# Altium schematic sheet LVDS_IFCB.SchDoc: LVDS Interface
size 420 x 297 mm; Author: G.K.; CompanyName: WUT; DrawnBy: G.K.; Organization: CERN; Address1: Warsaw Univeristy of Technology; Address2: Nowowiejska 15/19; DocumentNumber: 4; Revision: -; SheetNumber: 4; SheetTotal: 5; EDA_Number: ARTIQ; Projet: 3U ADC; ModifiedBy: -; CreateDate: XX/XX/XXXX; CheckedDate: -; Title2: I2C logic v1.2; DivGrp: ISE; Designer: G.K.; ModifiedDate: -; ProjectName: 3U ADC
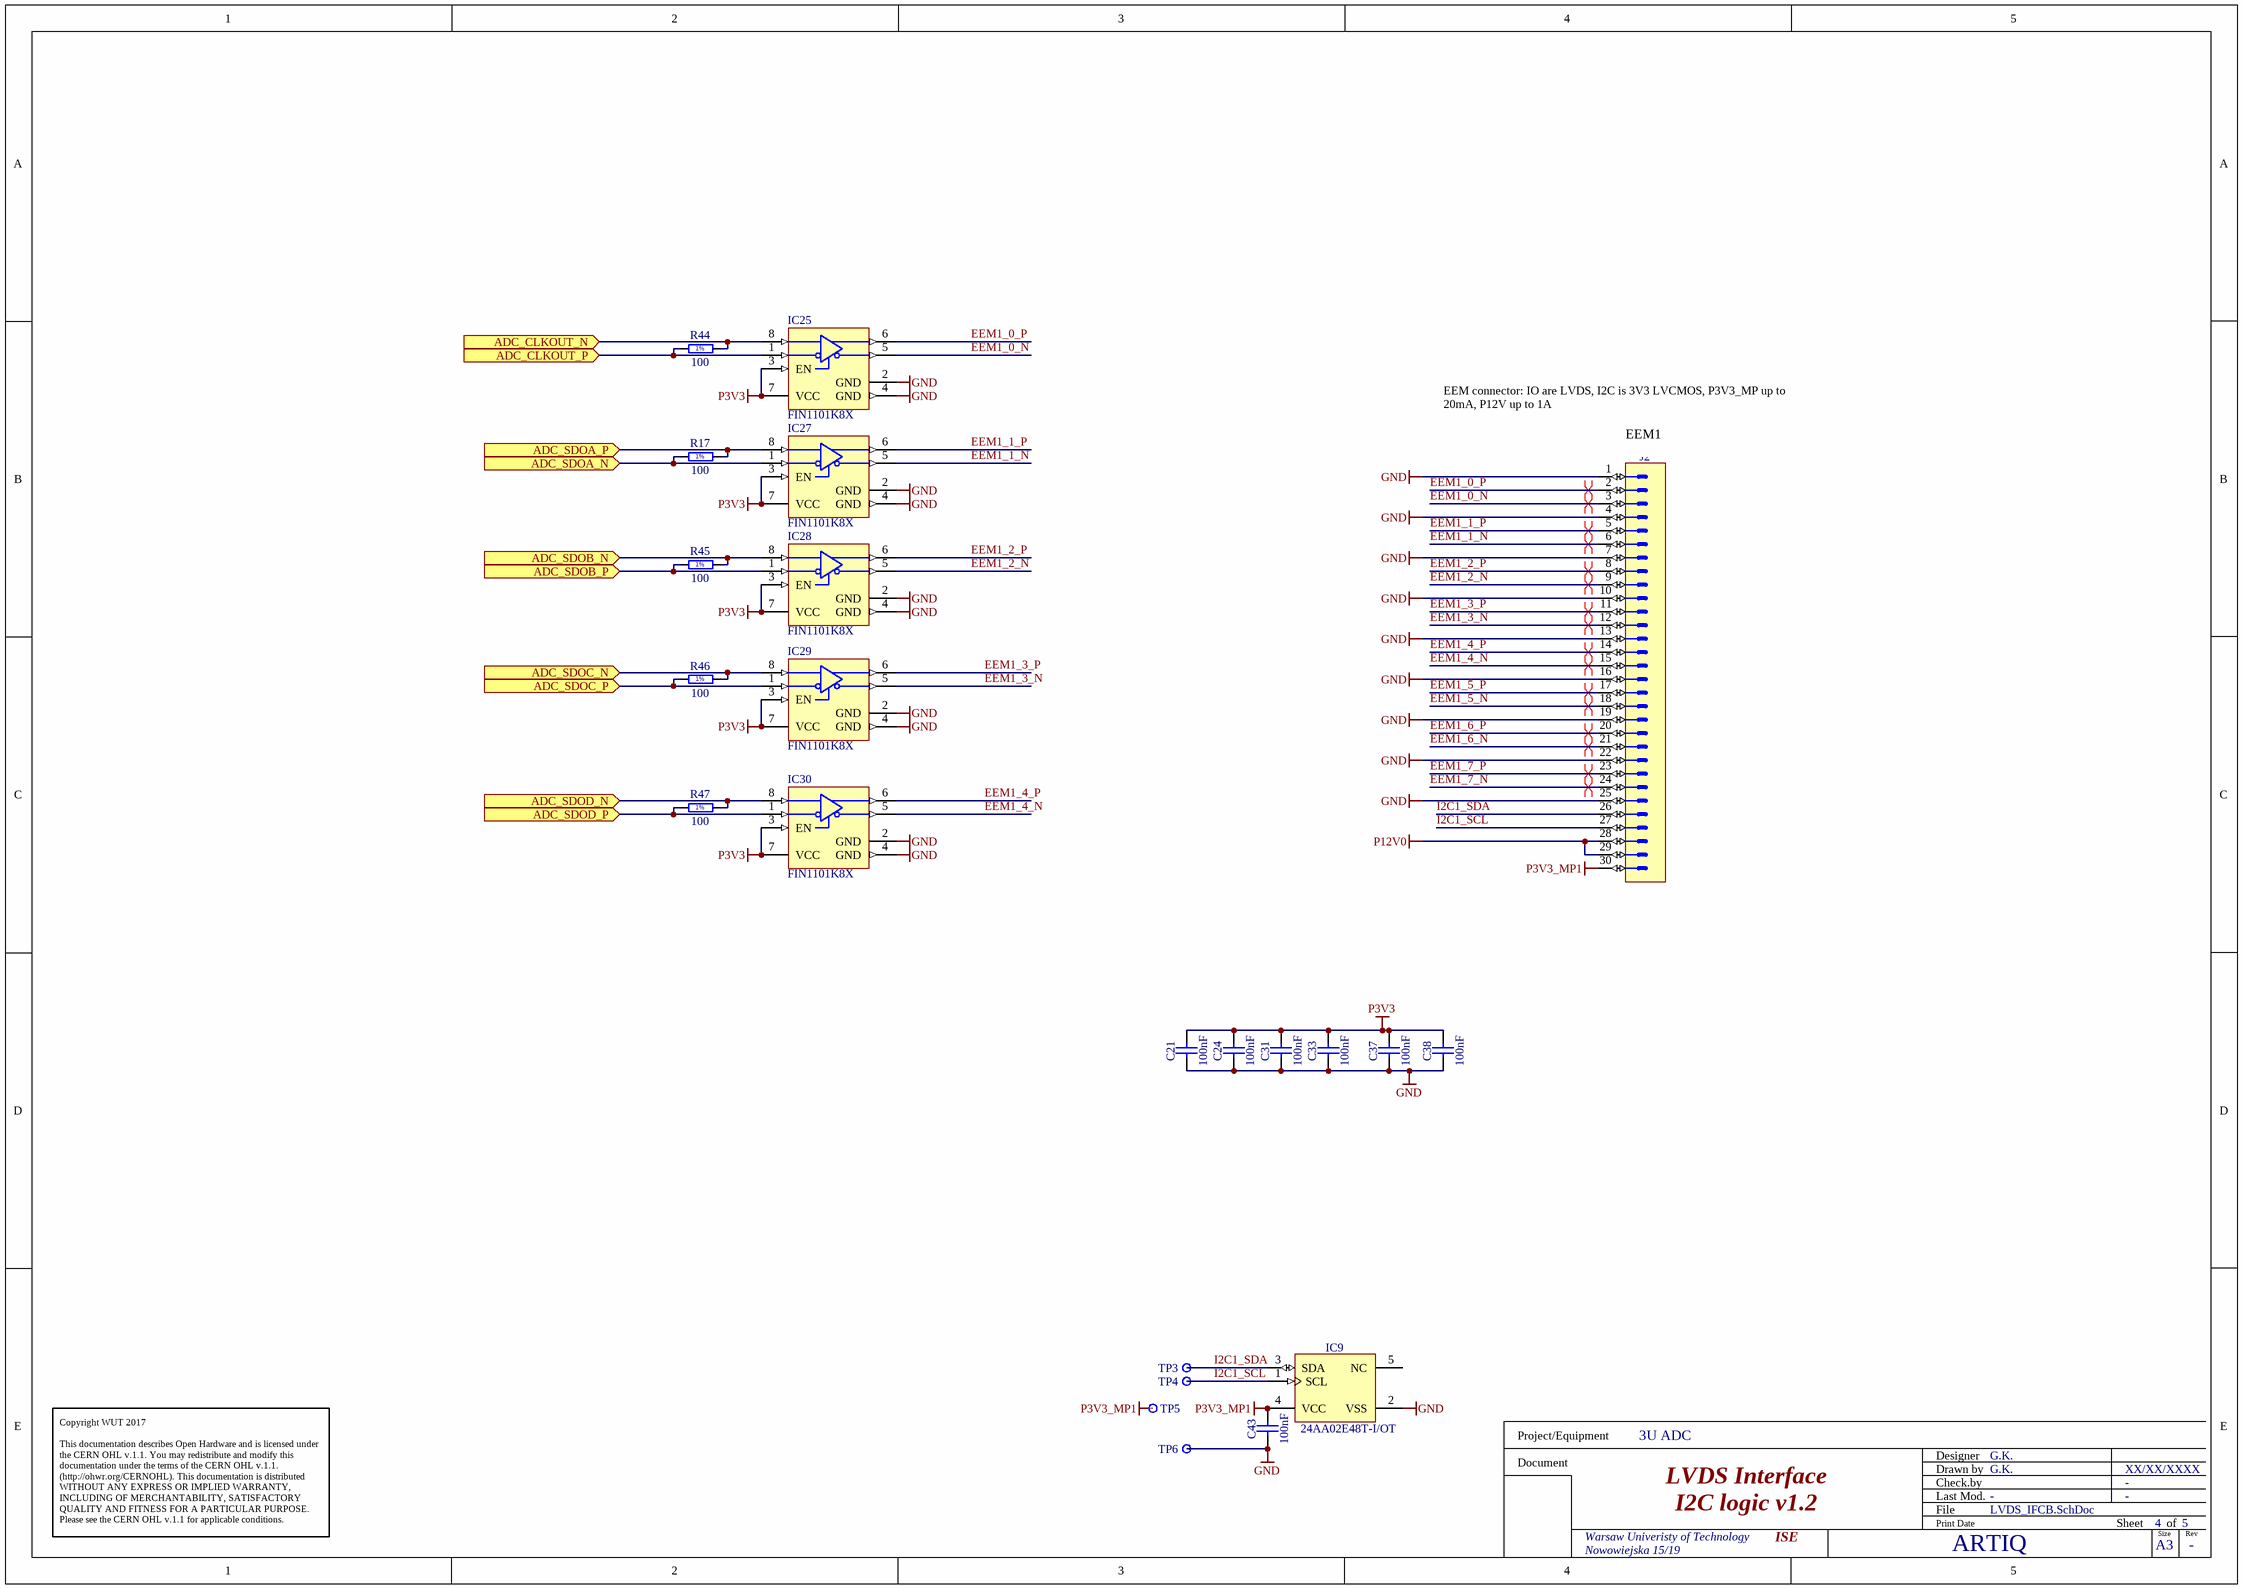
[diagram p0: LVDS_IFCB.SchDoc]

## Parts
C21  100nF  [CAPC1005X55N]
C24  100nF  [CAPC1005X55N]
C31  100nF  [CAPC1005X55N]
C33  100nF  [CAPC1005X55N]
C37  100nF  [CAPC1005X55N]
C38  100nF  [CAPC1005X55N]
C43  100nF  [CAPC1005X55N]
IC9  24AA02E48T-I/OT  [SOT95P280X145-5N]
IC25  FIN1101K8X  [SOP50P310X90-8N]
IC27  FIN1101K8X  [SOP50P310X90-8N]
IC28  FIN1101K8X  [SOP50P310X90-8N]
IC29  FIN1101K8X  [SOP50P310X90-8N]
IC30  FIN1101K8X  [SOP50P310X90-8N]
J2  (no value)  [3M_N2530-6002RB]
R17  100  [RESC1005X40N]
R44  100  [RESC1005X40N]
R45  100  [RESC1005X40N]
R46  100  [RESC1005X40N]
R47  100  [RESC1005X40N]
TP3  Test Point  [TPS127]  (value not drawn)
TP4  Test Point  [TPS127]  (value not drawn)
TP5  Test Point  [TPS127]  (value not drawn)
TP6  Test Point  [TPS127]  (value not drawn)

## Ports
ADC_CLKOUT_N (in), ADC_CLKOUT_P (in), ADC_SDOA_N (in), ADC_SDOA_P (in), ADC_SDOB_N (in), ADC_SDOB_P (in), ADC_SDOC_N (in), ADC_SDOC_P (in), ADC_SDOD_N (in), ADC_SDOD_P (in)

## Nets
GND: C21.1 C24.1 C31.1 C33.1 C37.1 C38.1 C43.1 IC9.2(VSS) IC25.2(GND) IC25.4(GND) IC27.2(GND) IC27.4(GND) IC28.2(GND) IC28.4(GND) IC29.2(GND) IC29.4(GND) IC30.2(GND) IC30.4(GND) J2.1 J2.4 J2.7 J2.10 J2.13 J2.16 J2.19 J2.22 J2.25 TP6.1
P3V3: C21.2 C24.2 C31.2 C33.2 C37.2 C38.2 IC25.3(EN) IC25.7(VCC) IC27.3(EN) IC27.7(VCC) IC28.3(EN) IC28.7(VCC) IC29.3(EN) IC29.7(VCC) IC30.3(EN) IC30.7(VCC)
P3V3_MP1: C43.2 IC9.4(VCC) J2.30 TP5.1
P12V0: J2.28 J2.29
ADC_CLKOUT_N: IC25.8(RIN+) R44.2 ; port ADC_CLKOUT_N
ADC_CLKOUT_P: IC25.1(RIN-) R44.1 ; port ADC_CLKOUT_P
ADC_SDOA_N: IC27.1(RIN-) R17.1 ; port ADC_SDOA_N
ADC_SDOA_P: IC27.8(RIN+) R17.2 ; port ADC_SDOA_P
ADC_SDOB_N: IC28.8(RIN+) R45.2 ; port ADC_SDOB_N
ADC_SDOB_P: IC28.1(RIN-) R45.1 ; port ADC_SDOB_P
ADC_SDOC_N: IC29.8(RIN+) R46.2 ; port ADC_SDOC_N
ADC_SDOC_P: IC29.1(RIN-) R46.1 ; port ADC_SDOC_P
ADC_SDOD_N: IC30.8(RIN+) R47.2 ; port ADC_SDOD_N
ADC_SDOD_P: IC30.1(RIN-) R47.1 ; port ADC_SDOD_P
EEM1_0_N: IC25.5(DOUT-) J2.3
EEM1_0_P: IC25.6(DOUT+) J2.2
EEM1_1_N: IC27.5(DOUT-) J2.6
EEM1_1_P: IC27.6(DOUT+) J2.5
EEM1_2_N: IC28.5(DOUT-) J2.9
EEM1_2_P: IC28.6(DOUT+) J2.8
EEM1_3_N: IC29.5(DOUT-) J2.12
EEM1_3_P: IC29.6(DOUT+) J2.11
EEM1_4_N: IC30.5(DOUT-) J2.15
EEM1_4_P: IC30.6(DOUT+) J2.14
EEM1_5_N: J2.18
EEM1_5_P: J2.17
EEM1_6_N: J2.21
EEM1_6_P: J2.20
EEM1_7_N: J2.24
EEM1_7_P: J2.23
I2C1_SCL: IC9.1(SCL) J2.27 TP4.1
I2C1_SDA: IC9.3(SDA) J2.26 TP3.1

Not connected (* = marked no-connect by the designer): IC9 5(NC)

## Layout directives
differential pair: EEM1_0_N, EEM1_0_P, EEM1_1_N, EEM1_1_P, EEM1_2_N, EEM1_2_P, EEM1_3_N, EEM1_3_P, EEM1_4_N, EEM1_4_P, EEM1_5_N, EEM1_5_P, EEM1_6_N, EEM1_6_P, EEM1_7_N, EEM1_7_P

## Notes on the sheet
- (near J2) EEM connector: IO are LVDS, I2C is 3V3 LVCMOS, P3V3_MP up to 20mA, P12V up to 1A
- (near J2) EEM1
- Copyright WUT 2017
  This documentation describes Open Hardware and is licensed under the CERN OHL v.1.1. You may redistribute and modify this documentation under the terms of the CERN OHL v.1.1. (http://ohwr.org/CERNOHL). This documentation is distributed WITHOUT ANY EXPRESS OR IMPLIED WARRANTY, INCLUDING OF MERCHANTABILITY, SATISFACTORY QUALITY AND FITNESS FOR A PARTICULAR PURPOSE. Please see the CERN OHL v.1.1 for applicable conditions.
- Project/Equipment
- Document
- Designer
- Drawn by
- Check.by
- File
- Last Mod.
- Print Date
- Sheet
- Size
- A3
- of
- Rev
- (in symbol R0402_100R_1%_0.1W_100PPM) 1%

## Library data of the parts
C21 C24 C31 C33 C37 C38 C43 = CC0402_100NF_16V_10%_X5R: Non-polarised capacitor; Part Description: SMD Multilayer Chip Ceramic Capacitor; Manufacturer: GENERIC; Manufacturer1 Part Number: GRM155R61C104KA88D; Voltage: 16V; TC: X5R; Tolerance: ±10%; Part Number: CC0402_100NF_16V_10%_X5R; Component Kind: Standard; Component Type: Standard; Pin Count: 2; Value: 100nF; Status: None; Manufacturer Part Number: CC0402_100NF_16V_10%_X5R; Case: 0402; Mounted: Yes; Socket: No; SMD: Yes; Sense: No; Manufacturer1 Example: MURATA; Manufacturer1 ComponentHeight: 0.55mm; HelpURL: \\cern.ch\dfs\Applications\Altium\Datasheets\CC0402_X5R_MURATA_GRM.pdf; Author: CERN DEM JLC; CreateDate: 10.12.2013; LatestRevisionDate: 10.12.2013
IC9 = 24AA02E48T-I/OT: 1.7V-5.5V, 2K I2C Serial EEPROM With EUI-48 Node Identity; Manufacturer: MICROCHIP TECHNOLOGY; PressFit: No; Bonding: No; Part Number: 24AA02E48T-I/OT; Component Kind: Standard; Component Type: Standard; Device: 24AA02E48T-I/OT; PackageDescription: SOT, 0.95mm pitch; 5 pin, 1.60mm W X 2.90mm L X 1.45mm H body, IPC Medium Density; Part Description: 1.7V-5.5V, 2K I2C Serial EEPROM With EUI-48 Node Identity; Manufacturer Part Number: 24AA02E48T-I/OT; Pin Count: 5; Case: SOT23-5; Mounted: Yes; Socket: No; SMD: Yes; Sense: No; ComponentHeight: 1.45mm; HelpURL: \\cern.ch\dfs\Applications\Altium\Datasheets\24AA02E48T-I-OT.pdf; Author: CERN DEM MR; CreateDate: 31.03.2016; LatestRevisionDate: 31.03.2016
IC25 IC27-IC30 = FIN1101K8X: LVDS Single Port High Speed Repeater; Manufacturer: FAIRCHILD SEMICONDUCTOR; PressFit: No; Bonding: No; Part Number: FIN1101K8X; Component Kind: Standard; Component Type: Standard; Device: FIN1101K8X; PackageDescription: SOP, 0.50mm Pitch; 8 pin, 2.30mm W X 2.00mm L X 0.90mm H body, PC Medium Density; Part Description: LVDS Single Port High Speed Repeater; Manufacturer Part Number: FIN1101K8X; Pin Count: 8; Case: TSSOP8; Mounted: Yes; Socket: No; SMD: Yes; Sense: No; ComponentHeight: 0.8mm; Author: CERN DEM JLC; HelpURL: \\cern.ch\dfs\Applications\Altium\Datasheets\FIN1101K8X.pdf; CreateDate: 08.11.2016; LatestRevisionDate: 08.11.2016
J2 = 3M_N2530-6002RB: Connector 30 Male; Part Description: 30 Contacts - Straight .100'' x .100'' Low Profile Four-Wall Header, 2500 Series; Manufacturer: 3M; PressFit: No; Part Number: 3M_N2530-6002RB; Component Kind: Standard; Component Type: Standard; Pin Count: 30; Family: Header 30; Mounted: Yes; Socket: No; SMD: No; Sense: No; Status: None; Manufacturer Part Number: N2530-6002RB; ComponentHeight: 10.03mm; HelpURL: \\cern.ch\dfs\Applications\Altium\Datasheets\3M_N2530-6002RB.pdf; Author: CERN DEM JLC; CreateDate: 11.02.2009; LatestRevisionDate: 11.08.2009
R17 R44-R47 = R0402_100R_1%_0.1W_100PPM: Resistor - 1%; Part Description: General Purpose Thick Film Chip Resistor; Manufacturer: GENERIC; Manufacturer Part Number: R0402_100R_1%_0.1W_100PPM_50V; Manufacturer1 Part Number: ERJ2RKF1000X; Power: 0.1W; TC: ±100ppm/°C; Voltage: 50V; Part Number: R0402_100R_1%_0.1W_100PPM; Component Kind: Standard; Component Type: Standard; Pin Count: 2; Value: 100; Status: Not recommended; Tolerance: ±1%; Case: 0402; Mounted: Yes; Sense: No; Socket: No; SMD: Yes; Manufacturer1 Example: PANASONIC; Manufacturer1 ComponentHeight: 0.4mm; HelpURL: \\cern.ch\dfs\Applications\Altium\Datasheets\R0402_PANASONIC_ERJ2RK.pdf; Author: CERN DEM JLC; CreateDate: 12.12.2013; LatestRevisionDate: 03.03.2015
TP3-TP6 = SMD_PAD_1.27X1.27MM: Part Description: 1.27mm x 1.27mm PCB Copper Area (SMD Test Point); Mounted: No; Part Number: SMD_PAD_1.27X1.27MM; Component Kind: Standard (No BOM); Component Type: Standard (No BOM); Pin Count: 1; Family: Test Point; Socket: No; SMD: Yes; Sense: No; Status: None; ComponentHeight: 0mm; HelpURL: Undefined; Author: CERN DEM JLC; CreateDate: 12.01.2008; LatestRevisionDate: 12.01.2008; PackageDescription: 1.27mm x 1.27mm PCB Copper Area (SMD Test Point)